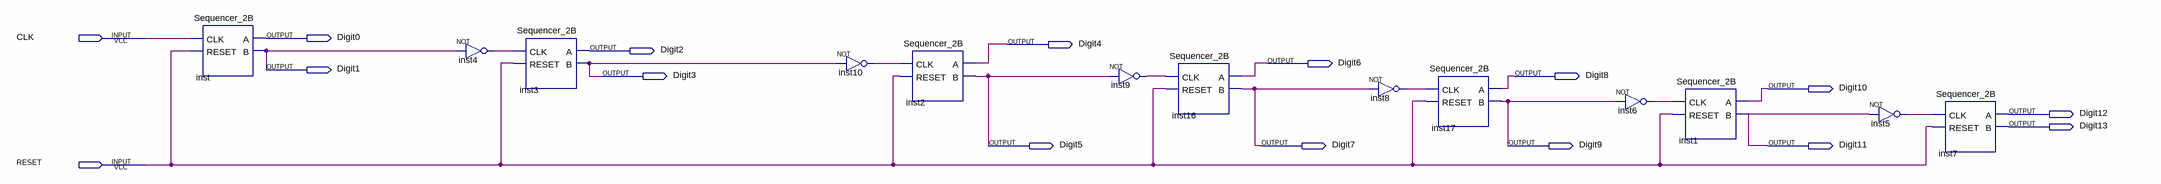
[diagram p0: schematic sheet]
// Quartus schematic counter14bit.bdf as structural Verilog: 13 symbols, 16 pins
module counter14bit (
  input  CLK,
  input  RESET,
  output Digit0,
  output Digit4,
  output Digit2,
  output Digit6,
  output Digit1,
  output Digit3,
  output Digit8,
  output Digit10,
  output Digit12,
  output Digit13,
  output Digit5,
  output Digit7,
  output Digit9,
  output Digit11
);

  wire inst4_out, inst5_out, inst6_out, inst8_out, inst9_out, inst10_out;

  Sequencer_2B inst (.CLK(CLK), .RESET(RESET), .A(Digit0), .B(Digit1));
  not inst4 (inst4_out, Digit1);
  Sequencer_2B inst3 (.CLK(inst4_out), .RESET(RESET), .A(Digit2), .B(Digit3));
  not inst10 (inst10_out, Digit3);
  Sequencer_2B inst2 (.CLK(inst10_out), .RESET(RESET), .A(Digit4), .B(Digit5));
  not inst9 (inst9_out, Digit5);
  Sequencer_2B inst16 (.CLK(inst9_out), .RESET(RESET), .A(Digit6), .B(Digit7));
  not inst8 (inst8_out, Digit7);
  Sequencer_2B inst17 (.CLK(inst8_out), .RESET(RESET), .A(Digit8), .B(Digit9));
  not inst6 (inst6_out, Digit9);
  Sequencer_2B inst1 (.CLK(inst6_out), .RESET(RESET), .A(Digit10), .B(Digit11));
  not inst5 (inst5_out, Digit11);
  Sequencer_2B inst7 (.CLK(inst5_out), .RESET(RESET), .A(Digit12), .B(Digit13));
endmodule
